# EAGLE schematic TD8Edaughter (EAGLE 6.6.0)

## Sheet 1 of 2
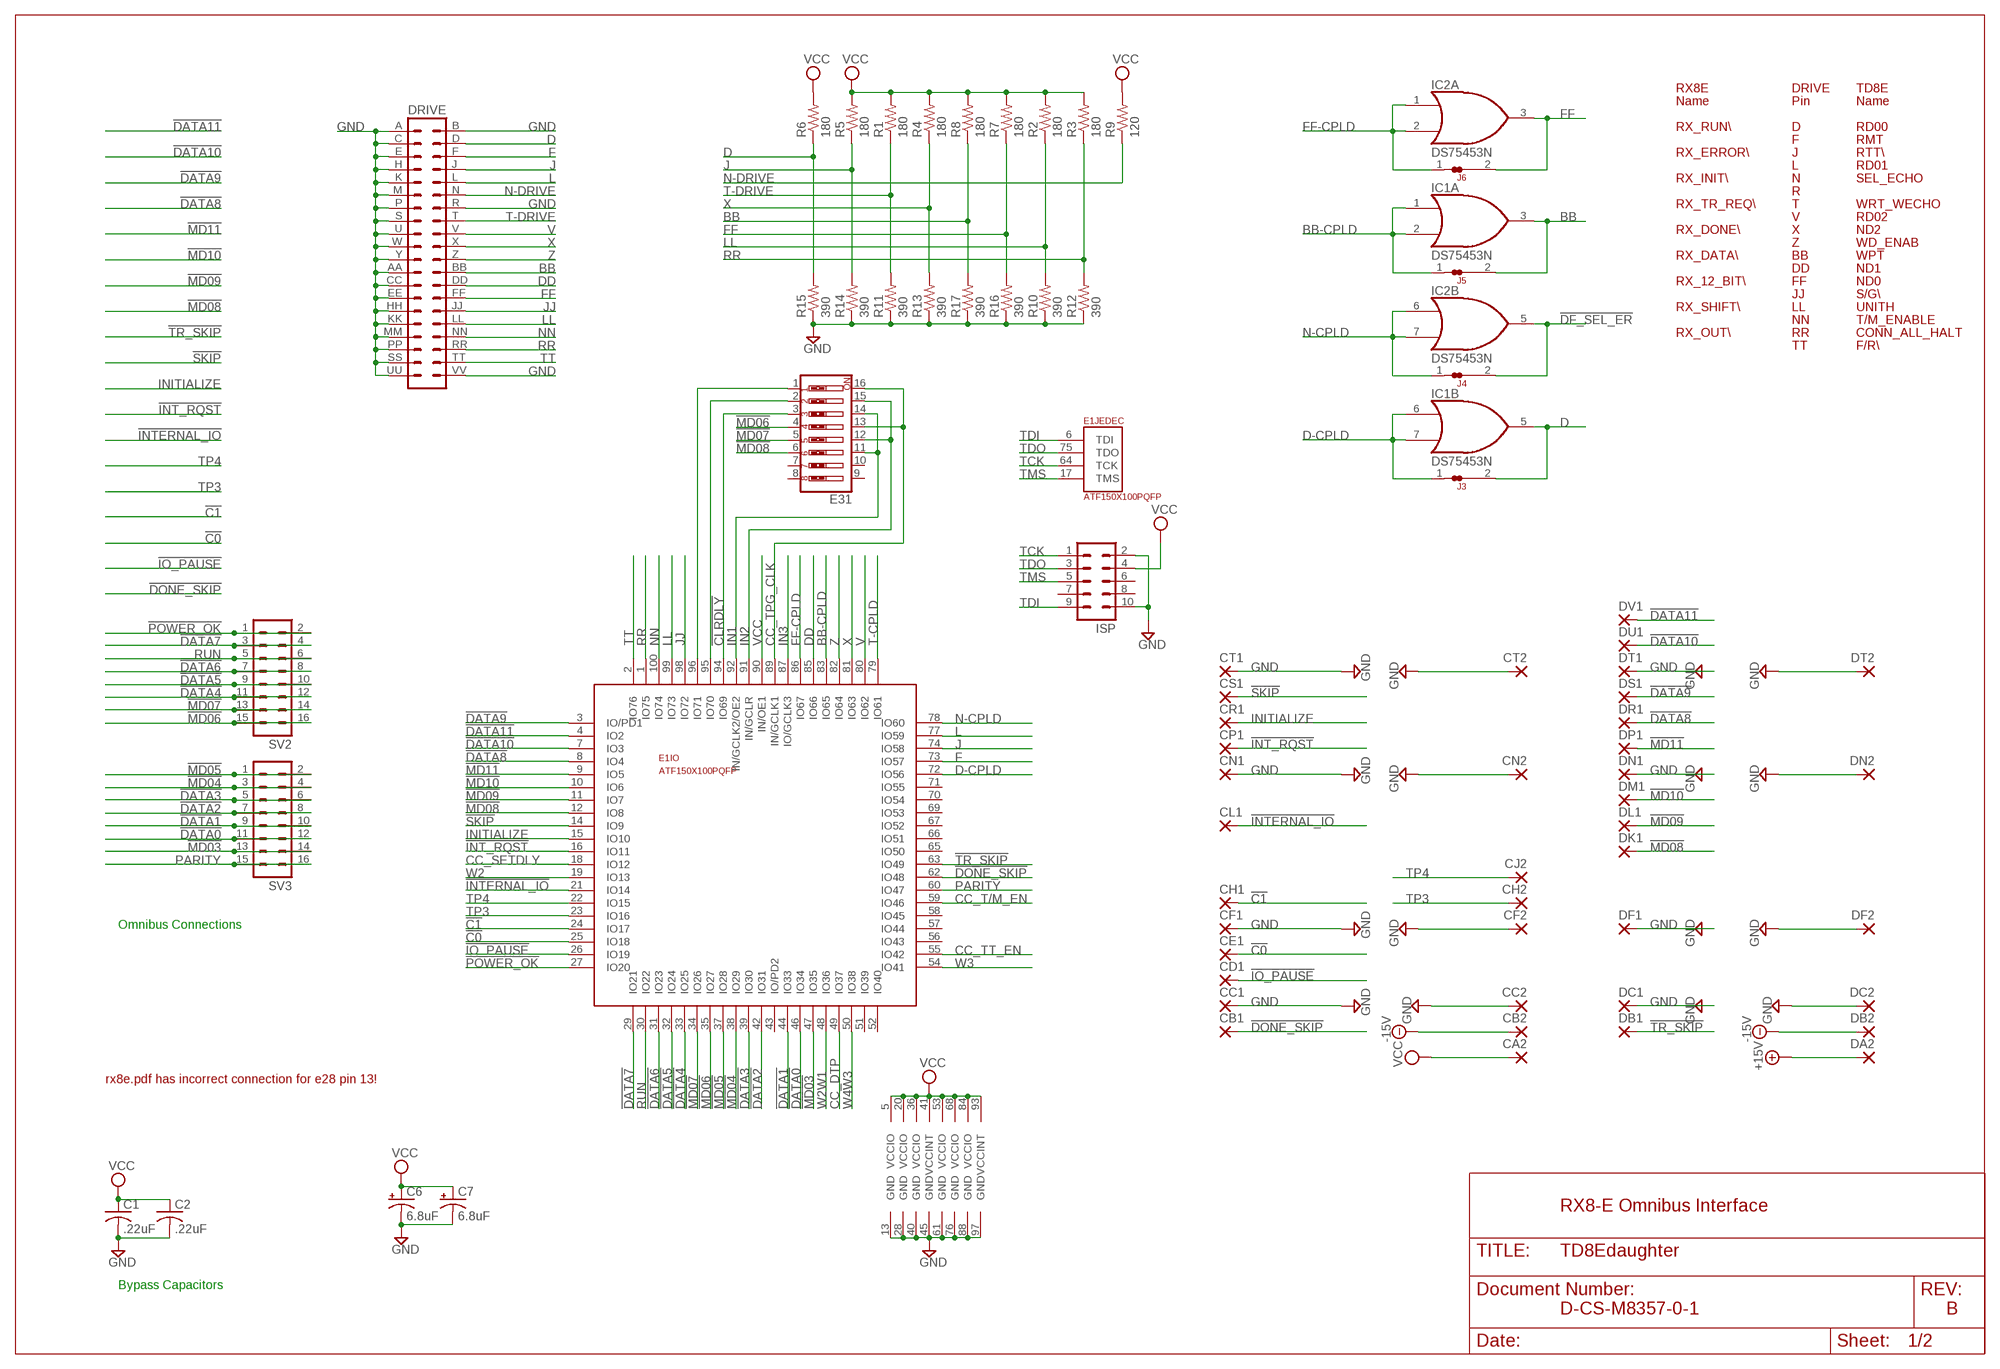
[diagram p0: schematic, sheet 1]

### Parts
C1  .22uF  C-US050-025X075  [C050-025X075]
C2  .22uF  C-US050-025X075  [C050-025X075]
C6  6.8uF  CPOL-USE20-8AXIAL  [E12-8]
C7  6.8uF  CPOL-USE20-8AXIAL  [E12-8]
CA2  1,6/0,9  [1,6/0,9]
CB1  1,6/0,9  [1,6/0,9]
CB2  1,6/0,9  [1,6/0,9]
CC1  1,6/0,9  [1,6/0,9]
CC2  1,6/0,9  [1,6/0,9]
CD1  1,6/0,9  [1,6/0,9]
CE1  1,6/0,9  [1,6/0,9]
CF1  1,6/0,9  [1,6/0,9]
CF2  1,6/0,9  [1,6/0,9]
CH1  1,6/0,9  [1,6/0,9]
CH2  1,6/0,9  [1,6/0,9]
CJ2  1,6/0,9  [1,6/0,9]
CL1  1,6/0,9  [1,6/0,9]
CN1  1,6/0,9  [1,6/0,9]
CN2  1,6/0,9  [1,6/0,9]
CP1  1,6/0,9  [1,6/0,9]
CR1  1,6/0,9  [1,6/0,9]
CS1  1,6/0,9  [1,6/0,9]
CT1  1,6/0,9  [1,6/0,9]
CT2  1,6/0,9  [1,6/0,9]
DA2  1,6/0,9  [1,6/0,9]
DB1  1,6/0,9  [1,6/0,9]
DB2  1,6/0,9  [1,6/0,9]
DC1  1,6/0,9  [1,6/0,9]
DC2  1,6/0,9  [1,6/0,9]
DF1  1,6/0,9  [1,6/0,9]
DF2  1,6/0,9  [1,6/0,9]
DK1  1,6/0,9  [1,6/0,9]
DL1  1,6/0,9  [1,6/0,9]
DM1  1,6/0,9  [1,6/0,9]
DN1  1,6/0,9  [1,6/0,9]
DN2  1,6/0,9  [1,6/0,9]
DP1  1,6/0,9  [1,6/0,9]
DR1  1,6/0,9  [1,6/0,9]
DRIVE  DEC40PINH  [DEC40PINH]
DS1  1,6/0,9  [1,6/0,9]
DT1  1,6/0,9  [1,6/0,9]
DT2  1,6/0,9  [1,6/0,9]
DU1  1,6/0,9  [1,6/0,9]
DV1  1,6/0,9  [1,6/0,9]
E1  ATF150X100PQFP  [PQFP-100]
E31  SW_DIP-8  [EDG-08]
IC1  DS75453N  [DIL08]
IC2  DS75453N  [DIL08]
ISP  ML10  [ML10]
J3  JUMPER-NC2  [NC2]
J4  JUMPER-NC2  [NC2]
J5  JUMPER-NC2  [NC2]
J6  JUMPER-NC2  [NC2]
R1  180  R-US_0207/10  [0207/10]
R2  180  R-US_0207/10  [0207/10]
R3  180  R-US_0207/10  [0207/10]
R4  180  R-US_0207/10  [0207/10]
R5  180  R-US_0207/10  [0207/10]
R6  180  R-US_0207/10  [0207/10]
R7  180  R-US_0207/10  [0207/10]
R8  180  R-US_0207/10  [0207/10]
R9  120  R-US_0207/10  [0207/10]
R10  390  R-US_0207/10  [0207/10]
R11  390  R-US_0207/10  [0207/10]
R12  390  R-US_0207/10  [0207/10]
R13  390  R-US_0207/10  [0207/10]
R14  390  R-US_0207/10  [0207/10]
R15  390  R-US_0207/10  [0207/10]
R16  390  R-US_0207/10  [0207/10]
R17  390  R-US_0207/10  [0207/10]
SV2  MA08-2  [MA08-2]
SV3  MA08-2  [MA08-2]

### Nets
!C0: CE1.1(P) E1.25(IO:IO18)
!C1: CH1.1(P) E1.24(IO:IO17)
!CLRDLY: E1.94(IO:IO69) E31.3 ; also sheet 2
!DATA0: E1.46(IO:IO34) SV3.11 SV3.12
!DATA1: E1.44(IO:IO33) SV3.9 SV3.10
!DATA2: E1.42(IO:IO31) SV3.7 SV3.8
!DATA3: E1.39(IO:IO30) SV3.5 SV3.6
!DATA4: E1.33(IO:IO25) SV2.11 SV2.12
!DATA5: E1.32(IO:IO24) SV2.9 SV2.10
!DATA6: E1.31(IO:IO23) SV2.7 SV2.8
!DATA7: E1.29(IO:IO21) SV2.3 SV2.4
!DATA8: DR1.1(P) E1.8(IO:IO4)
!DATA9: DS1.1(P) E1.3(IO:IO/PD1)
!DATA10: DU1.1(P) E1.7(IO:IO3)
!DATA11: DV1.1(P) E1.4(IO:IO2)
!DF_SEL_ER: IC2.5(B:O) J4.2 ; also sheet 2
!DONE_SKIP: CB1.1(P) E1.62(IO:IO48)
!INT_RQST: CP1.1(P) E1.16(IO:IO11)
!INTERNAL_IO: CL1.1(P) E1.21(IO:IO14)
!IO_PAUSE: CD1.1(P) E1.26(IO:IO19)
!MD03: E1.47(IO:IO35) SV3.13 SV3.14
!MD04: E1.38(IO:IO29) SV3.3 SV3.4
!MD05: E1.37(IO:IO28) SV3.1 SV3.2
!MD06: E1.35(IO:IO27) E31.4 SV2.15 SV2.16
!MD07: E1.34(IO:IO26) E31.5 SV2.13 SV2.14 ; also sheet 2
!MD08: DK1.1(P) E1.12(IO:IO8) E31.6 ; also sheet 2
!MD09: DL1.1(P) E1.11(IO:IO7)
!MD10: DM1.1(P) E1.10(IO:IO6)
!MD11: DP1.1(P) E1.9(IO:IO5)
!POWER_OK: E1.27(IO:IO20) SV2.1 SV2.2
!SKIP: CS1.1(P) E1.14(IO:IO9)
!TR_SKIP: DB1.1(P) E1.63(IO:IO49)
+15V: DA2.1(P)
-15V [supply]: CB2.1(P) DB2.1(P) ; also sheet 2
BB: DRIVE.BB IC1.3(A:O) J5.2 R8.1 R17.2
BB-CPLD: E1.83(IO:IO65) IC1.1(A:I0) IC1.2(A:I1) J5.1
CC_DTP: E1.49(IO:IO37) ; also sheet 2
CC_SETDLY: E1.18(IO:IO12) ; also sheet 2
CC_T/M_EN: E1.59(IO:IO46) ; also sheet 2
CC_TPG_CLK: E1.89(IO:IN/GCLK1) E31.13 E31.16 ; also sheet 2
CC_TT_EN: E1.55(IO:IO42) ; also sheet 2
D: DRIVE.D IC1.5(B:O) J3.2 R6.1 R15.2 ; also sheet 2
D-CPLD: E1.72(IO:IO56) IC1.6(B:I0) IC1.7(B:I1) J3.1
DD: DRIVE.DD E1.85(IO:IO66)
F: DRIVE.F E1.73(IO:IO57) ; also sheet 2
FF: DRIVE.FF IC2.3(A:O) J6.2 R7.1 R16.2
FF-CPLD: E1.86(IO:IO67) IC2.1(A:I0) IC2.2(A:I1) J6.1
GND [supply]: C1.2 C2.2 C6.- C7.- CC1.1(P) CC2.1(P) CF1.1(P) CF2.1(P) CN1.1(P) CN2.1(P) CT1.1(P) CT2.1(P) DC1.1(P) DC2.1(P) DF1.1(P) DF2.1(P) DN1.1(P) DN2.1(P) DRIVE.A DRIVE.AA DRIVE.B DRIVE.C DRIVE.CC DRIVE.E DRIVE.EE DRIVE.H DRIVE.HH DRIVE.K DRIVE.KK DRIVE.M DRIVE.MM DRIVE.P DRIVE.PP DRIVE.R DRIVE.S DRIVE.SS DRIVE.U DRIVE.UU DRIVE.VV DRIVE.W DRIVE.Y DT1.1(P) DT2.1(P) E1.13(GND) E1.28(GND) E1.40(GND) E1.45(GND) E1.61(GND) E1.76(GND) E1.88(GND) E1.97(GND) ISP.2 ISP.10 R10.1 R11.1 R12.1 R13.1 R14.1 R15.1 R16.1 R17.1 ; also sheet 2
IN1: E1.92(IO:IN/GCLK2/OE2) E31.11 E31.14 ; also sheet 2
IN2: E1.91(IO:IN/GCLR) E31.12 E31.15 ; also sheet 2
IN3: E1.87(IO:IO/GCLK3) ; also sheet 2
INITIALIZE: CR1.1(P) E1.15(IO:IO10)
J: DRIVE.J E1.74(IO:IO58) R5.1 R14.2 ; also sheet 2
JJ: DRIVE.JJ E1.98(IO:IO72)
L: DRIVE.L E1.77(IO:IO59) ; also sheet 2
LL: DRIVE.LL E1.99(IO:IO73) R2.1 R10.2
N$18: E1.95(IO:IO70) E31.2
N$19: E1.96(IO:IO71) E31.1
N-CPLD: E1.78(IO:IO60) IC2.6(B:I0) IC2.7(B:I1) J4.1
N-DRIVE: DRIVE.N R9.1 ; also sheet 2
NN: DRIVE.NN E1.100(IO:IO74)
PARITY: E1.60(IO:IO47) SV3.15 SV3.16
RR: DRIVE.RR E1.1(IO:IO75) R3.1 R12.2
RUN: E1.30(IO:IO22) SV2.5 SV2.6
T-CPLD: E1.79(IO:IO61) ; also sheet 2
T-DRIVE: DRIVE.T R1.1 R11.2 ; also sheet 2
TCK: E1.64(JEDEC:TCK) ISP.1
TDI: E1.6(JEDEC:TDI) ISP.9
TDO: E1.75(JEDEC:TDO) ISP.3
TMS: E1.17(JEDEC:TMS) ISP.5
TP3: CH2.1(P) E1.23(IO:IO16)
TP4: CJ2.1(P) E1.22(IO:IO15)
TT: DRIVE.TT E1.2(IO:IO76)
V: DRIVE.V E1.80(IO:IO62) ; also sheet 2
VCC [supply]: C1.1 C2.1 C6.+ C7.+ CA2.1(P) E1.5(VCCIO) E1.20(VCCIO) E1.36(VCCIO) E1.41(VCCINT) E1.53(VCCIO) E1.68(VCCIO) E1.84(VCCIO) E1.90(IO:IN/OE1) E1.93(VCCINT) ISP.4 R1.2 R2.2 R3.2 R4.2 R5.2 R6.2 R7.2 R8.2 R9.2 ; also sheet 2
W2: E1.19(IO:IO13) ; also sheet 2
W2W1: E1.48(IO:IO36) ; also sheet 2
W3: E1.54(IO:IO41) ; also sheet 2
W4W3: E1.50(IO:IO38) ; also sheet 2
X: DRIVE.X E1.81(IO:IO63) R4.1 R13.2
Z: DRIVE.Z E1.82(IO:IO64)
Unconnected: E1.43(IO:IO/PD2) E1.51(IO:IO39) E1.52(IO:IO40) E1.56(IO:IO43) E1.57(IO:IO44) E1.58(IO:IO45) E1.65(IO:IO50) E1.66(IO:IO51) E1.67(IO:IO52) E1.69(IO:IO53) E1.70(IO:IO54) E1.71(IO:IO55) E31.7 E31.8 E31.9 E31.10 ISP.6 ISP.7 ISP.8

### Notes on the sheet
- RX8E | DRIVE | TD8E
- Name | Pin | Name
- RX_RUN\\ | D | RD00
- F | RMT
- RX_ERROR\\ | J | RTT\\
- L | RD01
- RX_INIT\\ | N | SEL_ECHO
- R
- RX_TR_REQ\\ | T | WRT_WECHO
- V | RD02
- RX_DONE\\ | X | ND2
- Z | WD_ENAB
- RX_DATA\\ | BB | WPT
- DD | ND1
- RX_12_BIT\\ | FF | ND0
- JJ | S/G\\
- RX_SHIFT\\ | LL | UNITH
- NN | T/M_ENABLE
- RX_OUT\\ | RR | CONN_ALL_HALT
- TT | F/R\\
- Omnibus Connections
- rx8e.pdf has incorrect connection for e28 pin 13!
- RX8-E Omnibus Interface
- Bypass Capacitors
- D-CS-M8357-0-1 | B

## Sheet 2 of 2
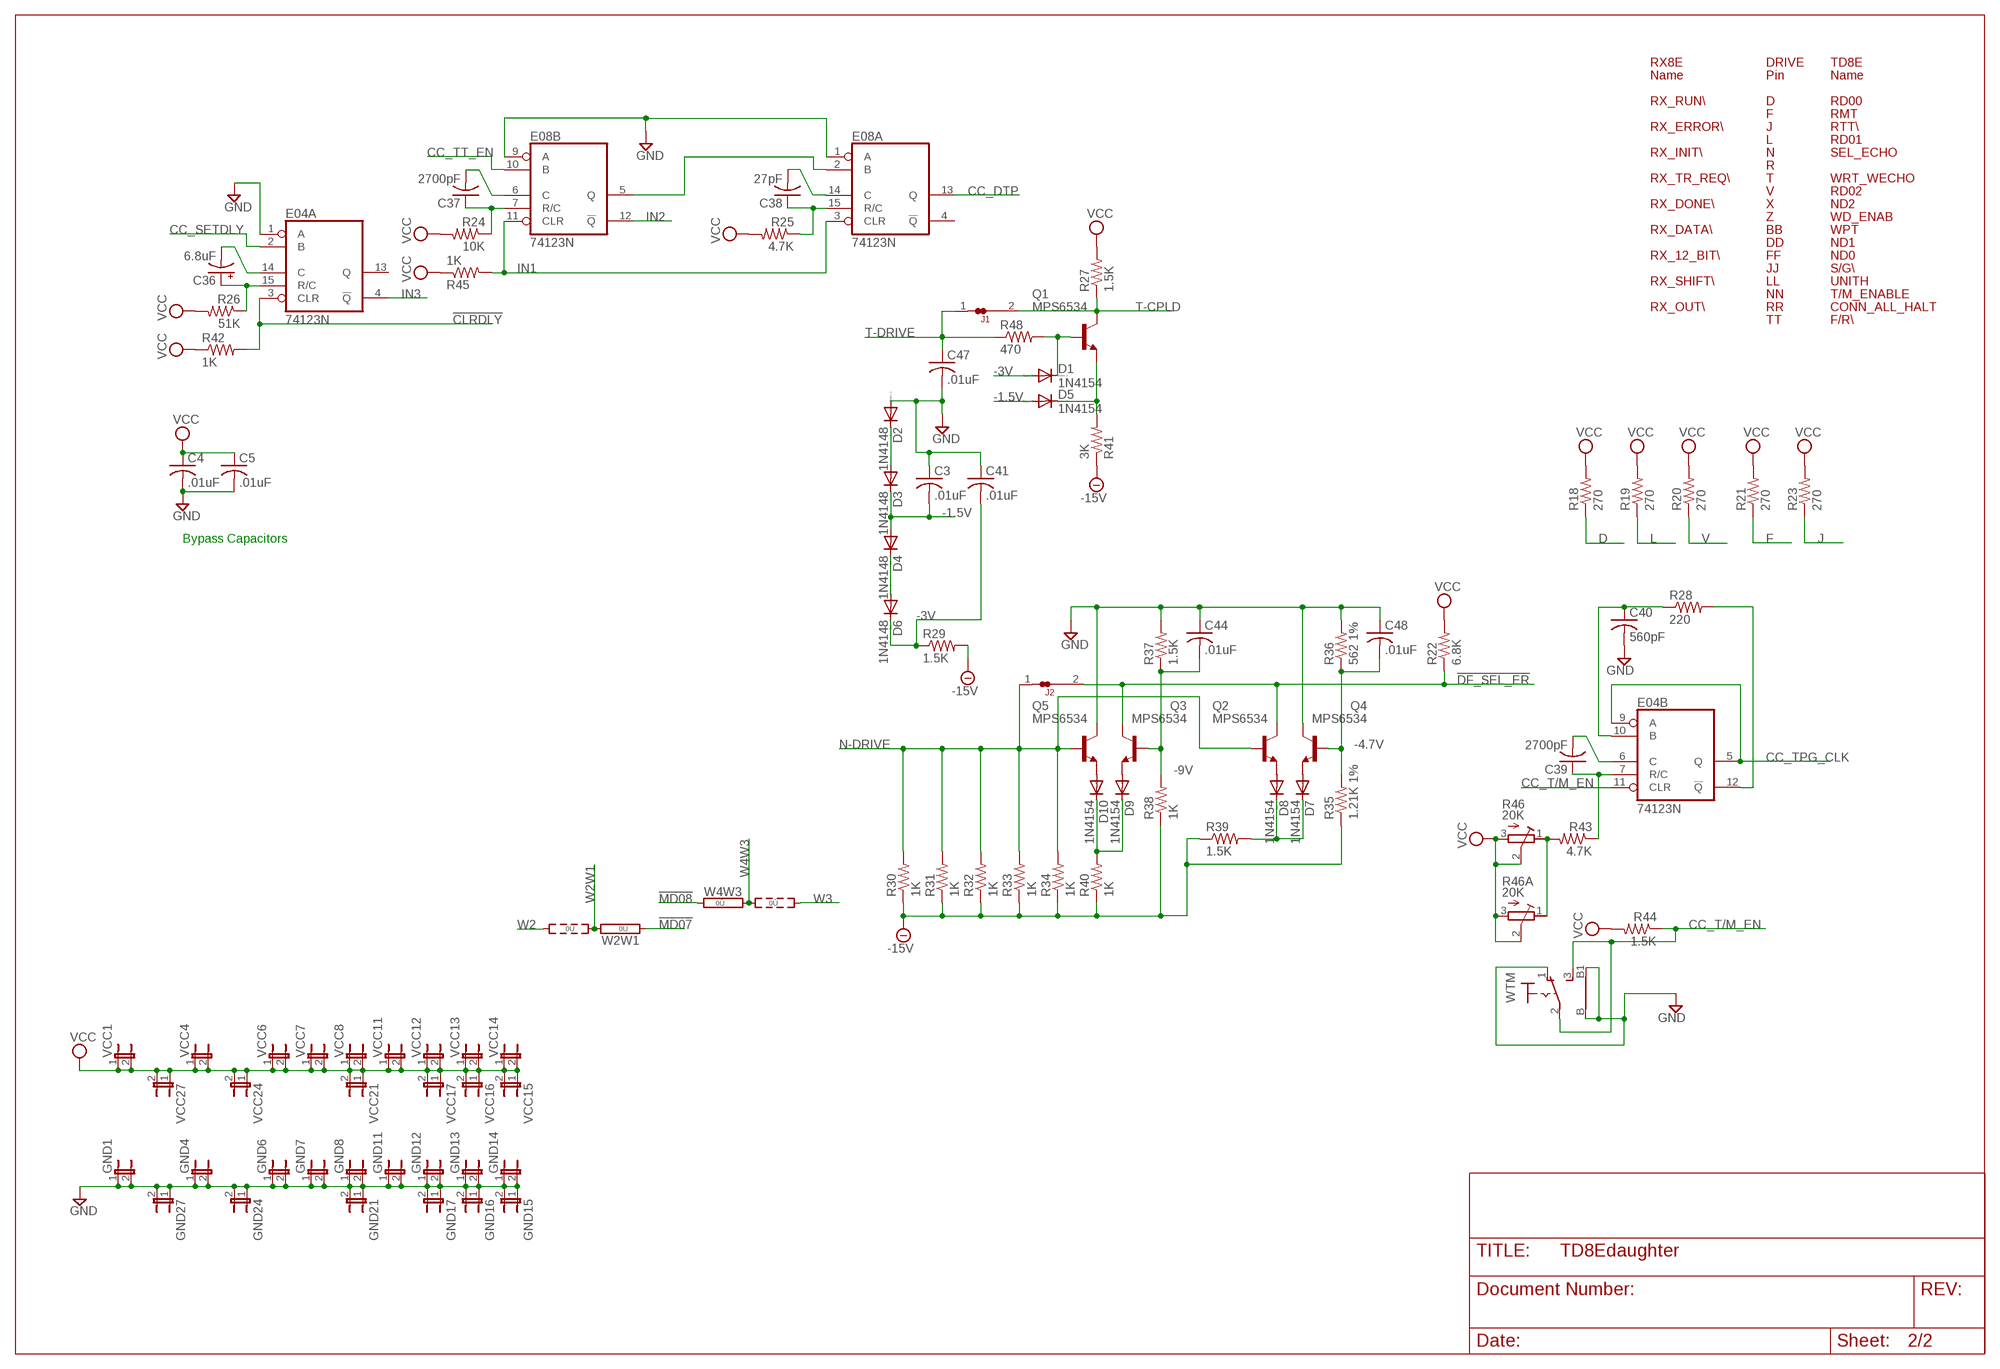
[diagram p1: schematic, sheet 2]

### Parts
C3  .01uF  C-US050-025X075  [C050-025X075]
C4  .01uF  C-US050-025X075  [C050-025X075]
C5  .01uF  C-US050-025X075  [C050-025X075]
C36  6.8uF  CPOL-USE20-8AXIAL  [E12-8]
C37  2700pF  C-US102-043X133  [C102-043X133]
C38  27pF  C-US050-025X075  [C050-025X075]
C39  2700pF  C-US102-043X133  [C102-043X133]
C40  560pF  C-US075-032X103  [C075-032X103]
C41  .01uF  C-US050-025X075  [C050-025X075]
C44  .01uF  C-US050-025X075  [C050-025X075]
C47  .01uF  C-US050-025X075  [C050-025X075]
C48  .01uF  C-US050-025X075  [C050-025X075]
D1  1N4154  1N4148DO35-10  [DO35-10]
D2  1N4148  1N4148DO35-10  [DO35-10]
D3  1N4148  1N4148DO35-10  [DO35-10]
D4  1N4148  1N4148DO35-10  [DO35-10]
D5  1N4154  1N4148DO35-10  [DO35-10]
D6  1N4148  1N4148DO35-10  [DO35-10]
D7  1N4154  1N4148DO35-10  [DO35-10]
D8  1N4154  1N4148DO35-10  [DO35-10]
D9  1N4154  1N4148DO35-10  [DO35-10]
D10  1N4154  1N4148DO35-10  [DO35-10]
E04  74123N  [DIL16]
E08  74123N  [DIL16]
GND1  JP1E  [JP1]
GND4  JP1E  [JP1]
GND6  JP1E  [JP1]
GND7  JP1E  [JP1]
GND8  JP1E  [JP1]
GND11  JP1E  [JP1]
GND12  JP1E  [JP1]
GND13  JP1E  [JP1]
GND14  JP1E  [JP1]
GND15  JP1E  [JP1]
GND16  JP1E  [JP1]
GND17  JP1E  [JP1]
GND21  JP1E  [JP1]
GND24  JP1E  [JP1]
GND27  JP1E  [JP1]
J1  JUMPER-NC  JUMPER-NC1  [NC1]
J2  JUMPER-NC  JUMPER-NC1  [NC1]
Q1  MPS6534  2N2219  [TO5]
Q2  MPS6534  2N2219  [TO5]
Q3  MPS6534  2N2219  [TO5]
Q4  MPS6534  2N2219  [TO5]
Q5  MPS6534  2N2219  [TO5]
R18  270  R-US_0207/10  [0207/10]
R19  270  R-US_0207/10  [0207/10]
R20  270  R-US_0207/10  [0207/10]
R21  270  R-US_0207/10  [0207/10]
R22  6.8K  R-US_0207/10  [0207/10]
R23  270  R-US_0207/10  [0207/10]
R24  10K  R-US_0207/10  [0207/10]
R25  4.7K  R-US_0207/10  [0207/10]
R26  51K  R-US_0207/10  [0207/10]
R27  1.5K  R-US_0207/10  [0207/10]
R28  220  R-US_0207/10  [0207/10]
R29  1.5K  R-US_0207/10  [0207/10]
R30  1K  R-US_0207/10  [0207/10]
R31  1K  R-US_0207/10  [0207/10]
R32  1K  R-US_0207/10  [0207/10]
R33  1K  R-US_0207/10  [0207/10]
R34  1K  R-US_0207/10  [0207/10]
R35  1.21K 1%  R-US_0207/15  [0207/15]
R36  562 1%  R-US_0207/15  [0207/15]
R37  1.5K  R-US_0207/10  [0207/10]
R38  1K  R-US_0207/10  [0207/10]
R39  1.5K  R-US_0207/10  [0207/10]
R40  1K  R-US_0207/10  [0207/10]
R41  3K  R-US_0207/10  [0207/10]
R42  1K  R-US_0207/10  [0207/10]
R43  4.7K  R-US_0207/10  [0207/10]
R44  1.5K  R-US_0207/10  [0207/10]
R45  1K  R-US_0207/10  [0207/10]
R46  20K  275P  [3006Y]
R46A  20K  R-TRIMM3006P  [RTRIM3006P]
R48  470  R-US_0207/10  [0207/10]
VCC1  JP1E  [JP1]
VCC4  JP1E  [JP1]
VCC6  JP1E  [JP1]
VCC7  JP1E  [JP1]
VCC8  JP1E  [JP1]
VCC11  JP1E  [JP1]
VCC12  JP1E  [JP1]
VCC13  JP1E  [JP1]
VCC14  JP1E  [JP1]
VCC15  JP1E  [JP1]
VCC16  JP1E  [JP1]
VCC17  JP1E  [JP1]
VCC21  JP1E  [JP1]
VCC24  JP1E  [JP1]
VCC27  JP1E  [JP1]
W2W1  0R2  [0R2/10]
W4W3  0R2  [0R2/10]
WTM  9070-1W  [9070-1W]

### Nets
!CC_TPG_CLK: C40.1 E04.10(B:B) R28.1
!CLRDLY: E04.3(A:CLR) R42.2 ; also sheet 1
!DF_SEL_ER: J2.2 Q2.3(C) Q3.3(C) R22.1 ; also sheet 1
!MD07: W2W1.1 ; also sheet 1
!MD08: W4W3.1 ; also sheet 1
-1.5V: C3.2 D3.C D4.A D5.A
-3V: C41.2 D1.A D6.C R29.1
-4.7V: C48.2 Q4.2(B) R35.2 R36.1
-9V: C44.2 Q3.2(B) R37.1 R38.2
-15V [supply]: R29.2 R30.1 R31.1 R32.1 R33.1 R34.1 R35.1 R38.1 R39.1 R40.1 R41.1 ; also sheet 1
CC_DTP: E08.13(A:Q) ; also sheet 1
CC_SETDLY: E04.2(A:B) ; also sheet 1
CC_T/M_EN: E04.11(B:CLR) R44.1 WTM.2(P) WTM.3(S) ; also sheet 1
CC_TPG_CLK: E04.5(B:Q) E04.9(B:A) ; also sheet 1
CC_TT_EN: E08.10(B:B) ; also sheet 1
D: R18.1 ; also sheet 1
F: R21.1 ; also sheet 1
GND [supply]: C3.1 C4.2 C5.2 C40.2 C41.1 C44.1 C47.2 C48.1 D2.A E04.1(A:A) E08.1(A:A) E08.9(B:A) GND1.1 GND1.2 GND4.1 GND4.2 GND6.1 GND6.2 GND7.1 GND7.2 GND8.1 GND8.2 GND11.1 GND11.2 GND12.1 GND12.2 GND13.1 GND13.2 GND14.1 GND14.2 GND15.1 GND15.2 GND16.1 GND16.2 GND17.1 GND17.2 GND21.1 GND21.2 GND24.1 GND24.2 GND27.1 GND27.2 Q4.3(C) Q5.3(C) R36.2 R37.2 WTM.1(O) WTM.B WTM.B1 ; also sheet 1
IN1: E08.3(A:CLR) E08.11(B:CLR) R45.2 ; also sheet 1
IN2: E08.12(B:!Q) ; also sheet 1
IN3: E04.4(A:!Q) ; also sheet 1
J: R23.1 ; also sheet 1
L: R19.1 ; also sheet 1
N$51: D1.C Q1.2(B) R48.2
N$52: D5.C Q1.1(E) R41.2
N$54: D2.C D3.A
N$55: D9.C D10.C R40.2
N$56: D4.C D6.A
N$57: D10.A Q5.1(E)
N$58: D9.A Q3.1(E)
N$59: D8.A Q2.1(E)
N$60: D7.A Q4.1(E)
N$63: D7.C D8.C R39.2
N$77: E08.2(A:B) E08.5(B:Q)
N$78: C37.1 E08.7(B:R/C) R24.1
N$79: C38.1 E08.15(A:R/C) R25.1
N$81: C38.2 E08.14(A:C)
N$82: C37.2 E08.6(B:C)
N$94: C36.+ E04.15(A:R/C) R26.1
N$95: C36.- E04.14(A:C)
N$108: C39.1 E04.7(B:R/C) R43.1
N$110: C39.2 E04.6(B:C)
N$111: R43.2 R46.1(A) R46A.1(E)
N$112: E04.12(B:!Q) R28.2
N-DRIVE: J2.1 Q2.2(B) Q5.2(B) R30.2 R31.2 R32.2 R33.2 R34.2 ; also sheet 1
T-CPLD: J1.2 Q1.3(C) R27.1 ; also sheet 1
T-DRIVE: C47.1 J1.1 R48.1 ; also sheet 1
V: R20.1 ; also sheet 1
VCC [supply]: C4.1 C5.1 R18.2 R19.2 R20.2 R21.2 R22.2 R23.2 R24.2 R25.2 R26.2 R27.2 R42.1 R44.2 R45.1 R46.2(S) R46.3(E) R46A.2(S) R46A.3(A) VCC1.1 VCC1.2 VCC4.1 VCC4.2 VCC6.1 VCC6.2 VCC7.1 VCC7.2 VCC8.1 VCC8.2 VCC11.1 VCC11.2 VCC12.1 VCC12.2 VCC13.1 VCC13.2 VCC14.1 VCC14.2 VCC15.1 VCC15.2 VCC16.1 VCC16.2 VCC17.1 VCC17.2 VCC21.1 VCC21.2 VCC24.1 VCC24.2 VCC27.1 VCC27.2 ; also sheet 1
W2: W2W1.3 ; also sheet 1
W2W1: W2W1.2 ; also sheet 1
W3: W4W3.3 ; also sheet 1
W4W3: W4W3.2 ; also sheet 1
Unconnected: E04.13(A:Q) E08.4(A:!Q)

### Notes on the sheet
- RX8E | DRIVE | TD8E
- Name | Pin | Name
- RX_RUN\\ | D | RD00
- F | RMT
- RX_ERROR\\ | J | RTT\\
- L | RD01
- RX_INIT\\ | N | SEL_ECHO
- R
- RX_TR_REQ\\ | T | WRT_WECHO
- V | RD02
- RX_DONE\\ | X | ND2
- Z | WD_ENAB
- RX_DATA\\ | BB | WPT
- DD | ND1
- RX_12_BIT\\ | FF | ND0
- JJ | S/G\\
- RX_SHIFT\\ | LL | UNITH
- NN | T/M_ENABLE
- RX_OUT\\ | RR | CONN_ALL_HALT
- TT | F/R\\
- Bypass Capacitors

## Power pins joined to a net without a drawn wire
GND: E04.8(P:GND) E08.8(P:GND) IC1.4(P:GND) IC2.4(P:GND)
VCC: E04.16(P:VCC) E08.16(P:VCC) IC1.8(P:VCC) IC2.8(P:VCC)

## Library data of the parts
C1-C5 C37-C41 C44 C47 C48 = rcl:C-US: CAPACITOR, American symbol
C6 C7 C36 = dec-con:CPOL-USE20-8AXIAL: A 0.8 inch electrolytic.
CA2 CB1 CB2 CC1 CC2 CD1 CE1 CF1 CF2 CH1 CH2 CJ2 CL1 CN1 CN2 CP1 CR1 CS1 CT1 CT2 DA2 DB1 DB2 DC1 DC2 DF1 DF2 DK1 DL1 DM1 DN1 DN2 DP1 DR1 DS1 DT1 DT2 DU1 DV1 = wirepad:1,6/0,9: THROUGH-HOLE PAD
D1-D10 = diode:1N4148: DIODE high speed (Philips)
DRIVE = dec-con:DEC40PIN: PIN HEADER
E1 = atmel-cpld:ATF150X100: ATF150x in 100 pin package.
E04 E08 = 74xx-us:74*123: Retriggerable monostable MULTIVIBRATOR
E31 = special:SW_DIP-8: DIP SWITCH
GND1 GND4 GND6-GND8 GND11-GND17 GND21 GND24 GND27 VCC1 VCC4 VCC6-VCC8 VCC11-VCC17 VCC21 VCC24 VCC27 = jumper:JP1E: JUMPER
IC1 IC2 = dec-con:DS75453: Quad 2-input OR gate, open collector output
ISP = con-harting-ml:ML10: HARTING; OC_FARNELL: unknown; OC_NEWARK: unknown
J1-J6 = dec-con:JUMPER: Normally closed SMD Jumper (Generates a DRC error.)
Q1-Q5 = transistor-npn:2N2219: NPN Transistor
R1-R45 R48 = rcl:R-US_: RESISTOR, American symbol
R46 = dec-con:275P: Trimpot with 275P (3006Y) footprint.
R46A = rcl:R-TRIMM: Trimm resistor
SV2 SV3 = con-lstb:MA08-2: PIN HEADER; OC_FARNELL: unknown; OC_NEWARK: unknown
W2W1 W4W3 = jumper:0R2: Bridge switch 0R 2 x 10mm
WTM = switch:9070-1W: TOGGLE SWITCH Marquardt